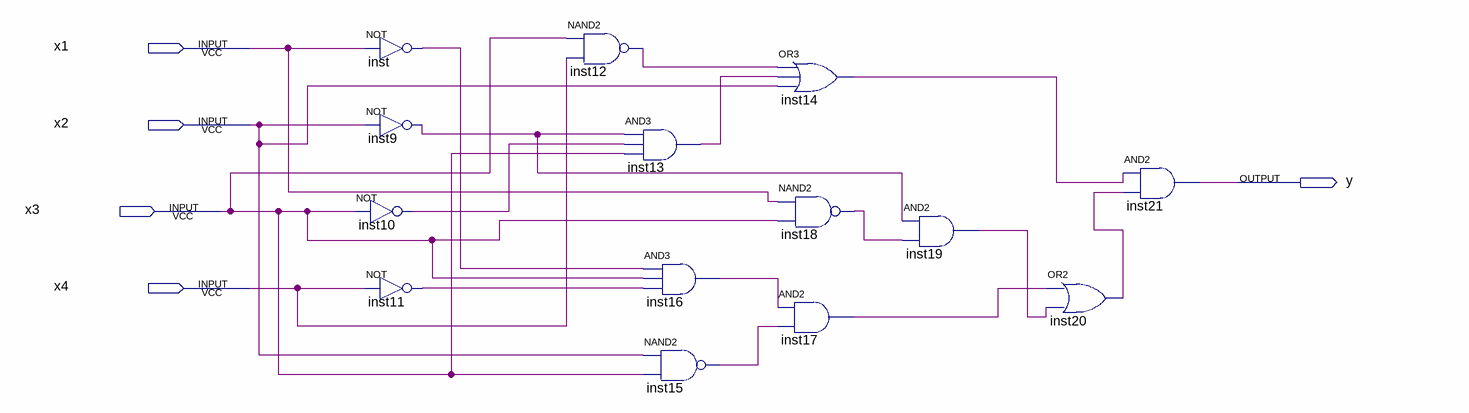
[diagram p0: schematic sheet]
// Quartus schematic Lab1.bdf as structural Verilog: 14 symbols, 5 pins
module Lab1 (
  input  x1,
  input  x2,
  input  x3,
  input  x4,
  output y
);

  wire inst9_out, inst10_out, inst11_out, inst12_out, inst13_out, inst14_out, inst15_out, inst16_out,
       inst17_out, inst18_out, inst19_out, inst20_out, inst_out;

  not inst (inst_out, x1);
  not inst9 (inst9_out, x2);
  not inst10 (inst10_out, x3);
  not inst11 (inst11_out, x4);
  nand inst12 (inst12_out, x3, x4);
  and inst13 (inst13_out, inst9_out, inst10_out, x3);
  and inst16 (inst16_out, inst_out, x3, inst11_out);
  nand inst15 (inst15_out, x2, x3);
  or inst14 (inst14_out, inst12_out, inst13_out, x2);
  nand inst18 (inst18_out, x1, x3);
  and inst17 (inst17_out, inst16_out, inst15_out);
  and inst19 (inst19_out, inst9_out, inst18_out);
  or inst20 (inst20_out, inst17_out, inst19_out);
  and inst21 (y, inst14_out, inst20_out);
endmodule
